# EAGLE design tricorder-teensy-mk-1.8 (EAGLE 7.5.0)
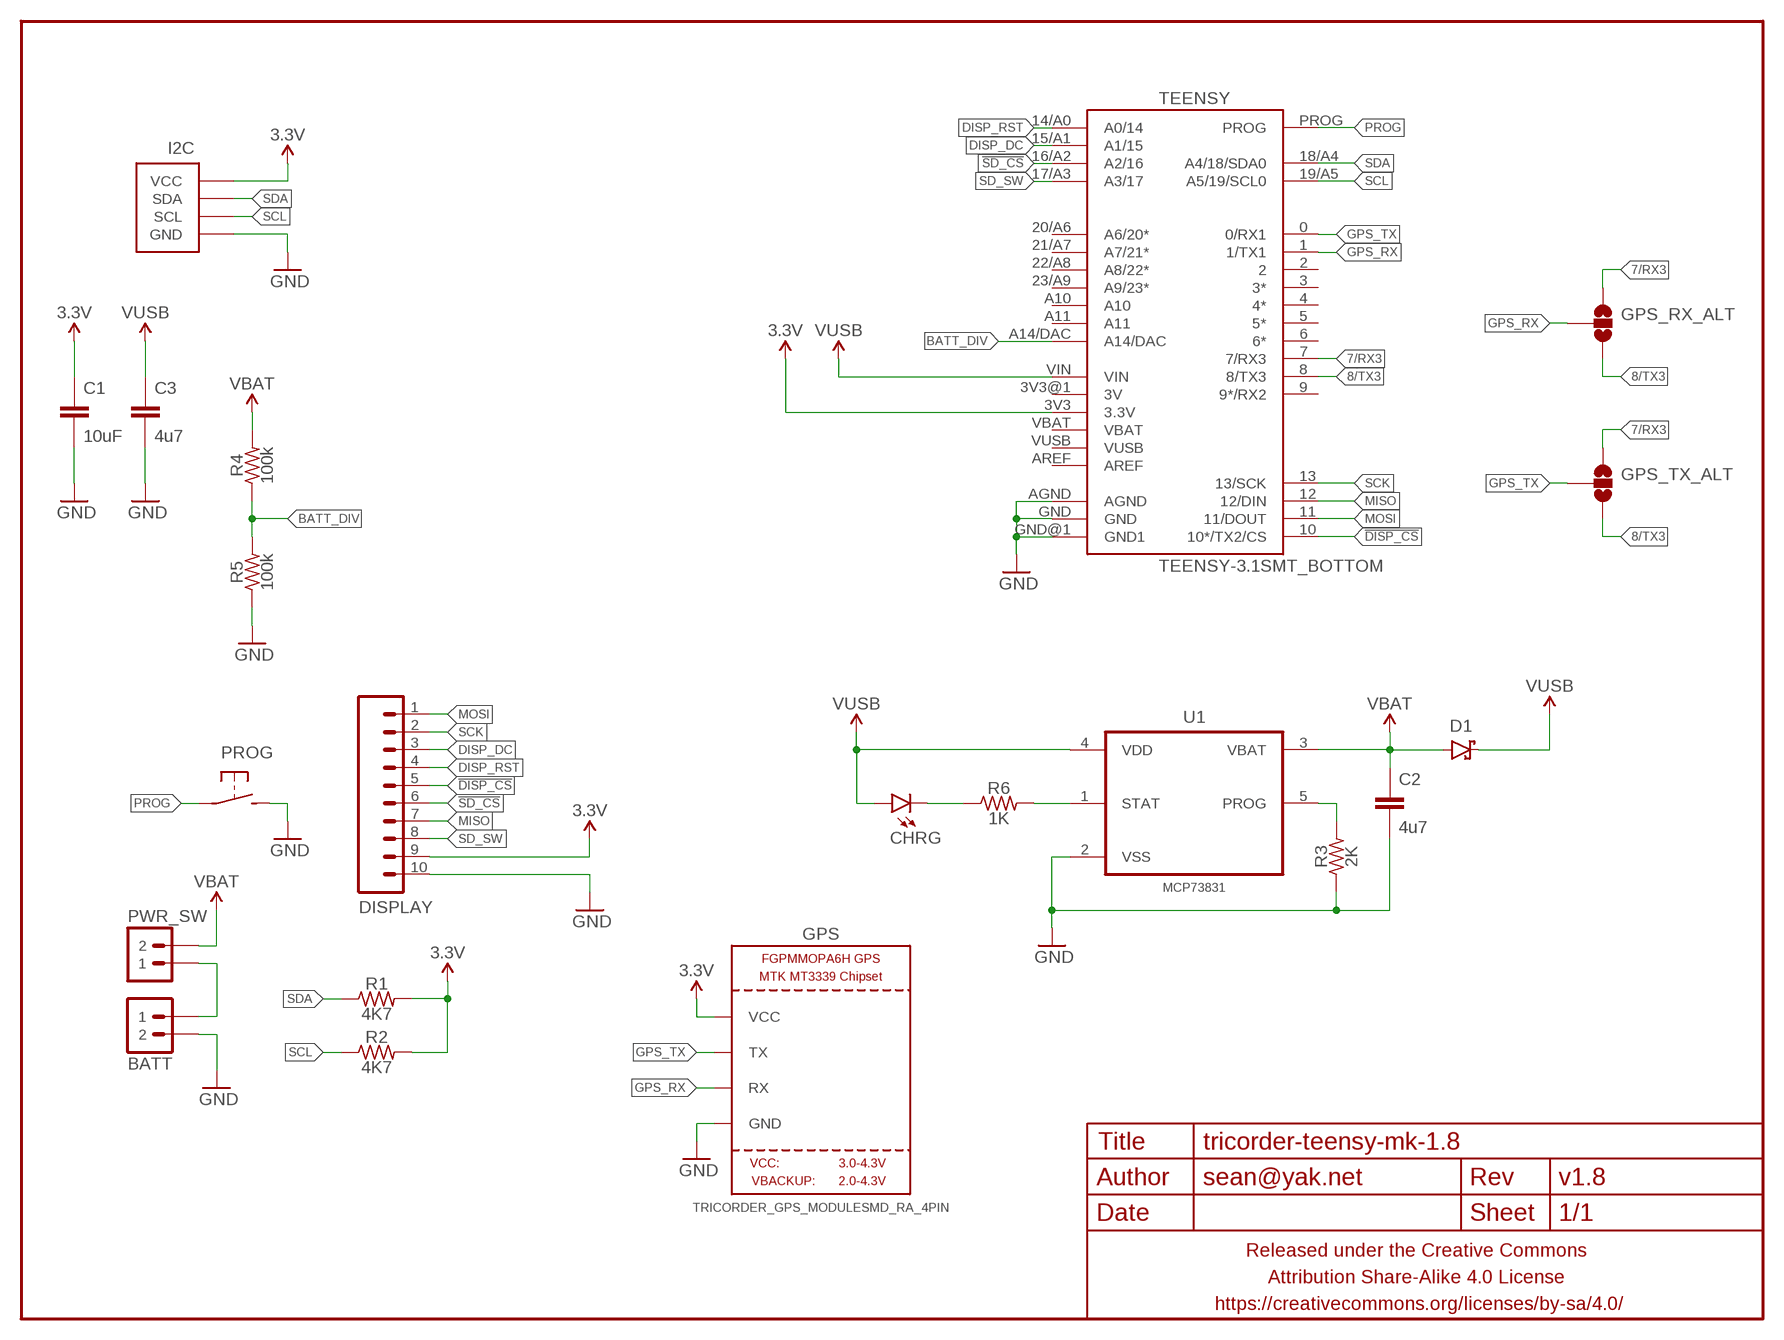
[diagram p0: schematic, sheet 1]

## Parts
BATT  M02JST-2MM-SMT  [JST-2-SMD]
C1  10uF  CAPACITOR-CERAMICC1210  [C1210]
C2  4u7  CAPACITOR-CERAMICC0603-TIGHTER  [C0603-TIGHTER]
C3  4u7  CAPACITOR-CERAMICC0603-TIGHTER  [C0603-TIGHTER]
CHRG  LED0603-TIGHT  [LED-0603-TIGHT]
D1  DIODE-SCHOTTKYSOD123  [SOD123-SCHOTTKY]
DISPLAY  M10SMD_RA_2MM  [1X10_SMD_RA_MALE]
FRAME1  FRAME-LETTERNO_PACKAGE  [DUMMY]
GPS  TRICORDER_GPS_MODULESMD_RA_4PIN  [TRICORDER_GPS_MODULE_RA_CONN_SMD_4PIN]
GPS_RX_ALT  JUMPER-PAD-3-NOFULL_BOX_SILK  [PAD-JUMPER-3-NO_YES_SILK_FULL_BOX]
GPS_TX_ALT  JUMPER-PAD-3-NOFULL_BOX_SILK  [PAD-JUMPER-3-NO_YES_SILK_FULL_BOX]
I2C  M04-I2CSMD_2MM_RA  [1X04_SMD_RA_2MM_I2C]
PROG  SPST-NO-TACTCK-PTS840-GK  [TACTILE-SMD-CK-PTS840-GK]
PWR_SW  M02JST-2MM-SMT  [JST-2-SMD]
R1  4K7  RESISTORR0603-TIGHTER  [R0603-TIGHTER]
R2  4K7  RESISTORR0603-TIGHTER  [R0603-TIGHTER]
R3  2K  RESISTORR0603-TIGHTER  [R0603-TIGHTER]
R4  100k  RESISTORR0603-TIGHTER  [R0603-TIGHTER]
R5  100k  RESISTORR0603-TIGHTER  [R0603-TIGHTER]
R6  1K  RESISTORR0603-TIGHTER  [R0603-TIGHTER]
TEENSY  TEENSY-3.1SMT_BOTTOM  [TEENSY-3.1_SMT_BOTTOM]
U1  MCP73831  MCP73831T-2ACI/OT  [SOT95P280X145-5N]

## Nets
3.3V: C1.1 DISPLAY.9 GPS.VCC I2C.VCC R1.2 R2.2 TEENSY.3V3(3.3V)
7/RX3: GPS_RX_ALT.1 GPS_TX_ALT.1 TEENSY.7(7/RX3)
8/TX3: GPS_RX_ALT.3 GPS_TX_ALT.3 TEENSY.8(8/TX3)
!DISP_CS: DISPLAY.5 TEENSY.10(10*/TX2/CS)
!SD_CS: DISPLAY.6 TEENSY.16/A2(A2/16)
BATT_DIV: R4.1 R5.2 TEENSY.A14/DAC
DISP_DC: DISPLAY.3 TEENSY.15/A1(A1/15)
DISP_RST: DISPLAY.4 TEENSY.14/A0(A0/14)
GND: BATT.1 C1.2 C2.2 C3.2 DISPLAY.10 GPS.GND I2C.GND PROG.3 PROG.4 R3.1 R5.1 TEENSY.AGND TEENSY.GND TEENSY.GND@1(GND1) U1.2(VSS)
GPS_RX: GPS.RX GPS_RX_ALT.2 TEENSY.1(1/TX1)
GPS_TX: GPS.TX GPS_TX_ALT.2 TEENSY.0(0/RX1)
MISO: DISPLAY.7 TEENSY.12(12/DIN)
MOSI: DISPLAY.1 TEENSY.11(11/DOUT)
N$1: R6.2 U1.1(STAT)
N$2: CHRG.C R6.1
N$4: R3.2 U1.5(PROG)
N$5: BATT.2 PWR_SW.2
PROG: PROG.1 PROG.2 TEENSY.PROG
SCK: DISPLAY.2 TEENSY.13(13/SCK)
SCL: I2C.SCL R2.1 TEENSY.19/A5(A5/19/SCL0)
SD_SW: DISPLAY.8 TEENSY.17/A3(A3/17)
SDA: I2C.SDA R1.1 TEENSY.18/A4(A4/18/SDA0)
VBAT: C2.1 D1.A PWR_SW.1 R4.2 U1.3(VBAT)
VUSB: C3.1 CHRG.A D1.C TEENSY.VIN U1.4(VDD)
Unconnected: TEENSY.2 TEENSY.3(3*) TEENSY.3V3@1(3V) TEENSY.4(4*) TEENSY.5(5*) TEENSY.6(6*) TEENSY.9(9*/RX2) TEENSY.20/A6(A6/20*) TEENSY.21/A7(A7/21*) TEENSY.22/A8(A8/22*) TEENSY.23/A9(A9/23*) TEENSY.A10 TEENSY.A11 TEENSY.AREF TEENSY.VBAT TEENSY.VUSB

## Library data of the parts
BATT PWR_SW = a_parts:M02: Standard 2-pin 0.1" header. Use with - straight break away headers ( PRT-00116) - right angle break away headers (PRT-00553) - swiss pins (PRT-00743) - machine pins (PRT-00117) - female headers (PRT-00115) Molex polarized connector foot print use with: PRT-08233 with associated crimp pins and housings. 2.54_SCREWTERM for use with PRT-10571. 3.5mm Screw Terminal footprints for PRT-08084 5mm Screw Terminal footprints for use with PRT-08433; PROD_ID: CONN-08352
C1-C3 = a_parts:CAPACITOR-CERAMIC: CAPACITOR, European symbol
CHRG = a_parts:LED: LEDs Standard schematic elements and footprints for 5mm, 3mm, 1206, and 0603 sized LEDs. 5mm - Spark Fun Electronics SKU : COM-00529 (and others)
D1 = a_parts:DIODE-SCHOTTKY: Schottky diodes in SFE's production catalog BAT20J 1A 23V 0.62Vf RB751 120mA 40V 0.37Vf PMEG4005EJ 0.5A 40V 0.42Vf MBRA140 1A 40V 0.5Vf B340A 3A 40V SMA
DISPLAY = a_parts:M10: Header 10 Standard 10-pin 0.1" header. Use with straight break away headers (SKU : PRT-00116), right angle break away headers (PRT-00553), swiss pins (PRT-00743), machine pins (PRT-00117), and female headers (PRT-00115).
FRAME1 = a_parts:FRAME-LETTER: Schematic Frame Standard 8.5x11 US Letter frame; DESIGNER: sean@yak.net; VERSION: v1.8
GPS = a_parts:TRICORDER_GPS_MODULE
GPS_RX_ALT GPS_TX_ALT = a_parts:JUMPER-PAD-3-NO
I2C = a_parts:M04-I2C
PROG = a_parts:SPST-NO-TACT
R1-R6 = a_parts:RESISTOR: RESISTOR, American symbol
TEENSY = a_parts:TEENSY-3.1
U1 = a_parts:MCP73831T-2ACI/OT: Charge Management Controller; MPN: MCP73831T-2ACI/OT; OC_FARNELL: 1332158; OC_NEWARK: 56K7045; PACKAGE: SOT-5; SUPPLIER: Microchip

## Board
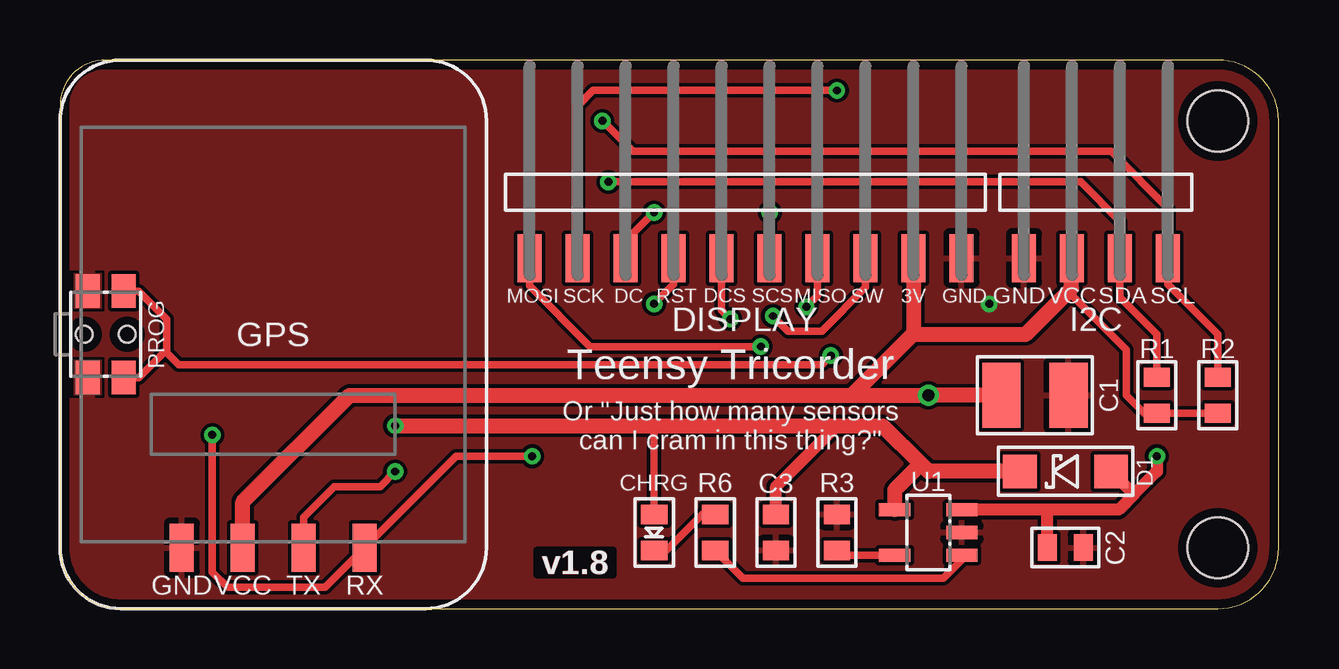
[diagram p1: board, top side]
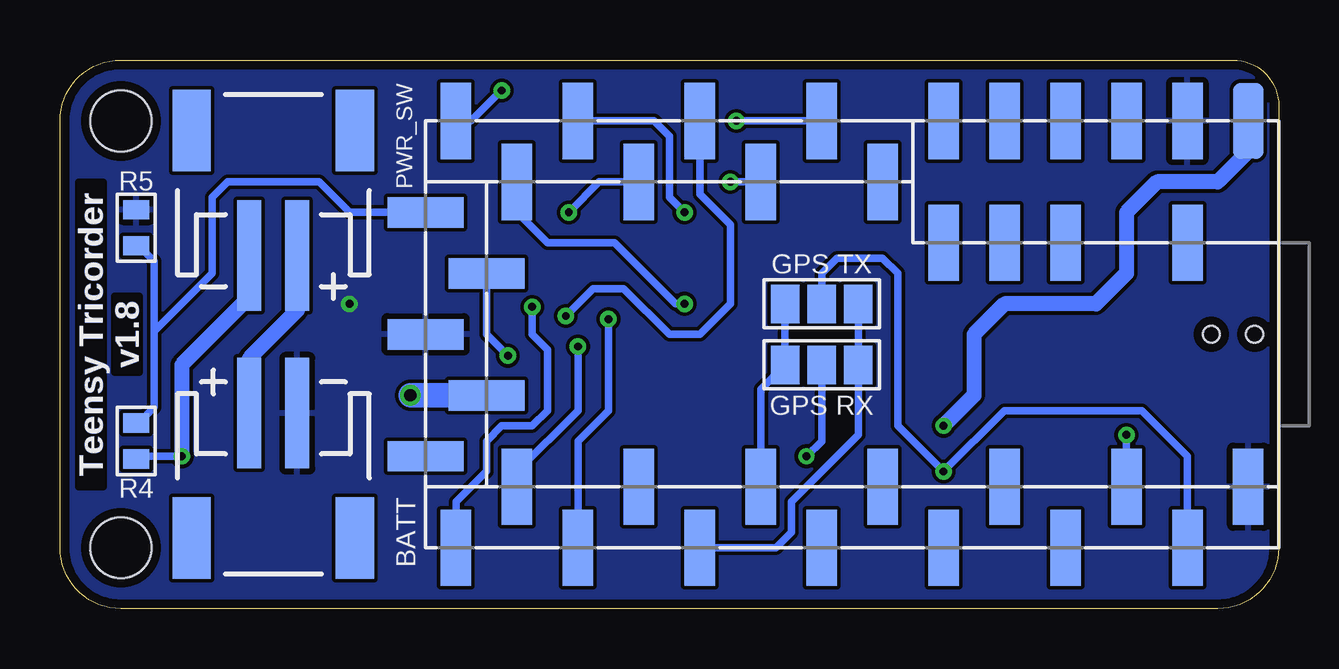
[diagram p2: board, bottom side, seen from below]

Size 50.8 x 22.86 mm. Coordinates in mm from the lower left corner, seen from the top.
Outline: 48.26,22.86 1.91,22.86 arc90 0,20.95 0,2.54 arc90 2.54,0 48.26,0 arc90 50.8,2.54 50.8,20.32 arc90 48.26,22.86
Copper layers (1*16): Top 0.0356mm / dielectric 1.5011mm / Bottom 0.0356mm
Design rules "LaenPCBOrder2": minimum track width 6mil, minimum drill 13mil, track to track 6mil, track to pad 6mil, pad to pad 6mil, via to via 6mil, smd to smd 6mil, copper to edge 15mil, drill to drill 6mil, minimum pad ring 7mil, minimum via ring 7mil, stop-mask expansion 3mil, vias tented up to drill 20mil, thermal gap 10mil
Holes 2.54 mm at 48.26,20.32 48.26,2.54

### Footprints (pad centres in the part's own frame; a part is rotated, then mirrored left to right if it is on the bottom)
JST-2-SMD = smd 1 x 4.6: 1 -1,-3.7; 2 1,-3.7 | smd 1.6 x 3.4: NC1 -3.4,1.5; NC2 3.4,1.5
C1210 = smd 1.6 x 2.7: 1 -1.4,0; 2 1.4,0
C0603-TIGHTER = smd 0.8 x 1.1: 1 -0.75,0; 2 0.75,0
LED-0603-TIGHT = smd 0.8 x 1.1: A 0.75,0; C -0.75,0
SOD123-SCHOTTKY = smd 1.4 x 1.4: A -1.9,0; C 1.9,0
1X10_SMD_RA_MALE = smd 1 x 2: 1 -9,0; 2 -7,0; 3 -5,0; 4 -3,0; 5 -1,0; 6 1,0; 7 3,0; 8 5,0; 9 7,0; 10 9,0
TRICORDER_GPS_MODULE_RA_CONN_SMD_4PIN = smd 1 x 2: GND 3.81,8.89; RX -3.81,8.89; TX -1.27,8.89; VCC 1.27,8.89
PAD-JUMPER-3-NO_YES_SILK_FULL_BOX = smd 1.2 x 1.6: 1 -1.524,0; 2 0,0; 3 1.524,0
1X04_SMD_RA_2MM_I2C = smd 1 x 2: GND -3,0; SCL 3,0; SDA 1,0; VCC -1,0
TACTILE-SMD-CK-PTS840-GK = smd 1.4 x 1: 1 -1.8,0.75; 2 1.8,0.75; 3 -1.8,-0.75; 4 1.8,-0.75 | hole 0.7: 0,-0.9; 0,0.9
R0603-TIGHTER = smd 0.8 x 1.1: 1 -0.75,0; 2 0.75,0
TEENSY-3.1_SMT_BOTTOM = smd 3.175 x 1.27 bottom: 0 8.89,-13.97; 1 6.35,-11.43; 2 8.89,-8.89; 3 6.35,-6.35; 3V3@1 -8.89,-11.43; 4 8.89,-3.81; 5 6.35,-1.27; 6 8.89,1.27; 7 6.35,3.81; 8 8.89,6.35; 9 6.35,8.89; 10 8.89,11.43; 11 6.35,13.97; 12 8.89,16.51; 13 -8.89,16.51; 14/A0 -6.35,13.97; 15/A1 -8.89,11.43; 16/A2 -6.35,8.89; 17/A3 -8.89,6.35; 18/A4 -6.35,3.81; 19/A5 -8.89,1.27; 20/A6 -6.35,-1.27; 21/A7 -8.89,-3.81; 22/A8 -8.89,-6.35; 23/A9 -8.89,-8.89; A10 -3.81,-6.35; A11 -3.81,-3.81; AGND -8.89,-13.97; AREF -3.81,-8.89; GND 6.35,-16.51; VIN -8.89,-16.51; VUSB -3.81,-13.97 | smd 1.27 x 3.175 bottom: 3V3 2.54,15.24; A14/DAC -5.08,17.78; GND@1 0,17.78; PROG -2.54,15.24; VBAT 5.08,17.78
SOT95P280X145-5N = smd 1.3 x 0.55: 1 -1.4,0.95; 2 -1.4,0; 3 -1.4,-0.95; 4 1.4,-0.95; 5 1.4,0.95

### Placement (x,y rotation side)
BATT  41.91,4.45 180 bottom
C1  40.64,8.89 0 top
C2  41.91,2.54 0 top
C3  29.84,3.17 270 top
CHRG  24.77,3.17 90 top
D1  41.91,5.71 180 top
DISPLAY  28.57,14.61 0 top
FRAME1  0,0 0 top
GPS  8.89,11.43 180 top
GPS_RX_ALT  19.05,10.16 0 bottom
GPS_TX_ALT  19.05,12.7 0 bottom
I2C  43.18,14.61 0 top
PROG  1.91,11.43 270 top
PWR_SW  41.91,18.41 0 bottom
R1  45.72,8.89 270 top
R2  48.26,8.89 270 top
R3  32.38,3.17 270 top
R4  47.62,6.99 270 bottom
R5  47.62,15.88 270 bottom
R6  27.3,3.17 270 top
TEENSY  17.78,11.43 270 top
U1  36.2,3.17 180 top

### Tracks (layer width: path | path; a pad name or v marks a point on that pad's centre or on a via)
3.3V  (via drill 0.51)
  Top 0.305: R2.2 R1.2 45.2,8.14 44.45,8.89 44.45,10.79 42.04,13.21
  Top 0.635: GPS.VCC 7.62,4.45 12.06,8.89 TEENSY.3V3 | I2C.VCC 42.16,14.59 42.16,13.34 42.04,13.21 40.26,11.43 35.56,11.43 | TEENSY.3V3 35.56,11.43 | DISPLAY.9 35.58,11.45 35.56,11.43 | TEENSY.3V3 v36.2,8.89 C1.1
  Bottom 1.016: v36.2,8.89 TEENSY.3V3
7/RX3
  Bottom 0.305: TEENSY.7 21.59,9.14 GPS_RX_ALT.1 GPS_TX_ALT.1
8/TX3
  Bottom 0.305: TEENSY.8 20.95,2.54 20.32,3.17 20.32,4.45 17.53,7.24 GPS_RX_ALT.3 GPS_TX_ALT.3
!DISP_CS  (via drill 0.33)
  Top 0.305: DISPLAY.5 27.57,12.43 v27.94,12.06
  Bottom 0.305: TEENSY.10 29.21,6.99 27.94,8.26 v27.94,12.06
!SD_CS  (via drill 0.33)
  Top 0.305: v29.59,16.51 29.59,14.62 DISPLAY.6
  Bottom 0.305: TEENSY.16/A2 28.32,17.78 v29.59,16.51
BATT_DIV
  Bottom 0.305: R4.1 47.51,7.74 46.86,8.38 46.86,11.56 | 46.86,11.56 44.45,13.97 44.45,17.14 43.81,17.78 40.01,17.78 38.73,16.51 TEENSY.A14/DAC | R5.2 47.51,15.12 46.86,14.48 46.86,11.56
DISP_DC  (via drill 0.33)
  Top 0.305: v24.77,16.51 23.57,15.32 DISPLAY.3
  Bottom 0.305: TEENSY.15/A1 26.04,20.32 25.4,19.68 25.4,17.14 v24.77,16.51
DISP_RST  (via drill 0.33)
  Top 0.305: v24.77,12.7 25.57,13.51 DISPLAY.4
  Bottom 0.305: TEENSY.14/A0 31.75,16.51 30.48,15.24 27.69,15.24 25.15,12.7 v24.77,12.7
GND  (via drill 0.33)
  other vias: 38.73,12.7
  pour Bottom: 48.26,22.86 1.91,22.86 arc90 0,20.95 0,2.54 arc90 2.54,0 48.26,0 arc90 50.8,2.54 50.8,20.32 arc90
  pour Top: 48.26,22.86 1.91,22.86 arc90 0,20.95 0,2.54 arc90 2.54,0 48.26,0 arc90 50.8,2.54 50.8,20.32 arc90
GPS_RX  (via drill 0.33)
  Top 0.305: v19.68,6.35 16.51,6.35 GPS.RX 11.05,0.89 6.99,0.89 6.35,1.52 v6.35,7.24
  Bottom 0.305: GPS_RX_ALT.2 19.05,6.99 v19.68,6.35 | TEENSY.1 v6.35,7.24
GPS_TX  (via drill 0.33)
  Top 0.305: v13.97,5.71 13.34,5.08 11.43,5.08 10.16,3.81 GPS.TX
  Bottom 0.305: GPS_TX_ALT.2 19.05,13.97 18.41,14.61 16.51,14.61 15.88,13.97 15.88,7.62 v13.97,5.71 11.43,8.26 5.71,8.26 3.81,6.35 TEENSY.0
MISO  (via drill 0.33)
  Top 0.305: v31.11,12.57 31.57,13.03 DISPLAY.7
  Bottom 0.305: TEENSY.12 34.29,4.45 33.02,5.71 33.02,6.99 32.38,7.62 31.11,7.62 30.48,8.26 30.48,10.79 31.11,11.43 v31.11,12.57
MOSI  (via drill 0.33)
  Top 0.305: v29.21,10.92 22.1,10.92 19.57,13.45 DISPLAY.1
  Bottom 0.305: TEENSY.11 31.75,5.71 29.21,8.26 v29.21,10.92
N$1
  Top 0.305: U1.1 37.59,2.04 36.83,1.27 28.46,1.27 R6.2
N$2
  Top 0.305: CHRG.C 25.29,2.42 26.79,3.92 R6.1
N$4
  Top 0.305: U1.5 32.59,2.23 R3.2
N$5
  Bottom 0.635: BATT.2 42.91,10.43 40.91,12.43 PWR_SW.2
PROG  (via drill 0.33)
  Top 0.305: PROG.2 3.28,9.63 4.38,10.73 | 4.38,10.73 4.45,10.79 4.45,12.06 3.28,13.23 PROG.1 | v32.13,10.54 31.75,10.16 4.95,10.16 4.38,10.73
  Bottom 0.305: TEENSY.PROG 33.02,11.43 v32.13,10.54
SCK  (via drill 0.33)
  Top 0.305: v32.38,21.59 22.23,21.59 21.59,20.95 21.59,14.62 DISPLAY.2
  Bottom 0.305: TEENSY.13 33.66,20.32 v32.38,21.59
SCL  (via drill 0.33)
  Top 0.305: R2.1 48.26,11.43 46.18,13.51 I2C.SCL 46.23,14.65 46.23,16.64 43.81,19.05 23.88,19.05 v22.61,20.32
  Bottom 0.305: TEENSY.19/A5 v22.61,20.32
SD_SW  (via drill 0.33)
  Top 0.305: DISPLAY.8 33.58,13.38 31.75,11.56 30.35,11.56 v29.72,12.19
  Bottom 0.305: TEENSY.17/A3 24.13,17.27 22.86,16 22.86,12.7 24.13,11.43 25.4,11.43 27.3,13.34 28.57,13.34 v29.72,12.19
SDA  (via drill 0.33)
  Top 0.305: R1.1 45.72,11.43 44.18,12.97 I2C.SDA 44.2,14.62 44.2,16.13 42.55,17.78 v22.86,17.78
  Bottom 0.305: TEENSY.18/A4 v22.86,17.78
VBAT  (via drill 0.33)
  Top 0.508: v45.72,6.35 45.72,5.71 44.77,4.76 | 44.77,4.76 44.13,4.12 41.15,4.12 | 41.15,4.12 U1.3 | D1.A 44.76,4.76 44.77,4.76 | C2.1 41.15,2.55 41.15,4.12
  Bottom 0.305: v45.72,6.35 47.51,6.35 R4.2
  Bottom 0.635: PWR_SW.1 42.91,12.97 45.72,10.16 v45.72,6.35
VUSB  (via drill 0.33)
  Top 0.305: CHRG.A 24.77,7.62
  Top 0.508: C3.1 29.84,5.08 32.38,7.62
  Top 0.635: D1.C 36.2,5.71 35.88,6.03 | v13.97,7.62 24.77,7.62 32.38,7.62 34.29,7.62 35.88,6.03 | U1.4 34.8,4.95 35.88,6.03
  Bottom 0.635: TEENSY.VIN 1.27,19.05 2.54,17.78 5.08,17.78 6.35,16.51 6.35,13.97 7.62,12.7 11.43,12.7 12.7,11.43 12.7,8.89 v13.97,7.62

### Text on the board
Bottom: Teensy Tricorder
tPlace: MOSI | SCK | DC | RST | DCS | SCS | MISO | SW | 3V | GND | Teensy Tricorder | Or "Just how many sensors / can I cram in this thing?"
bPlace: GPS TX | Teensy Tricorder | GPS RX